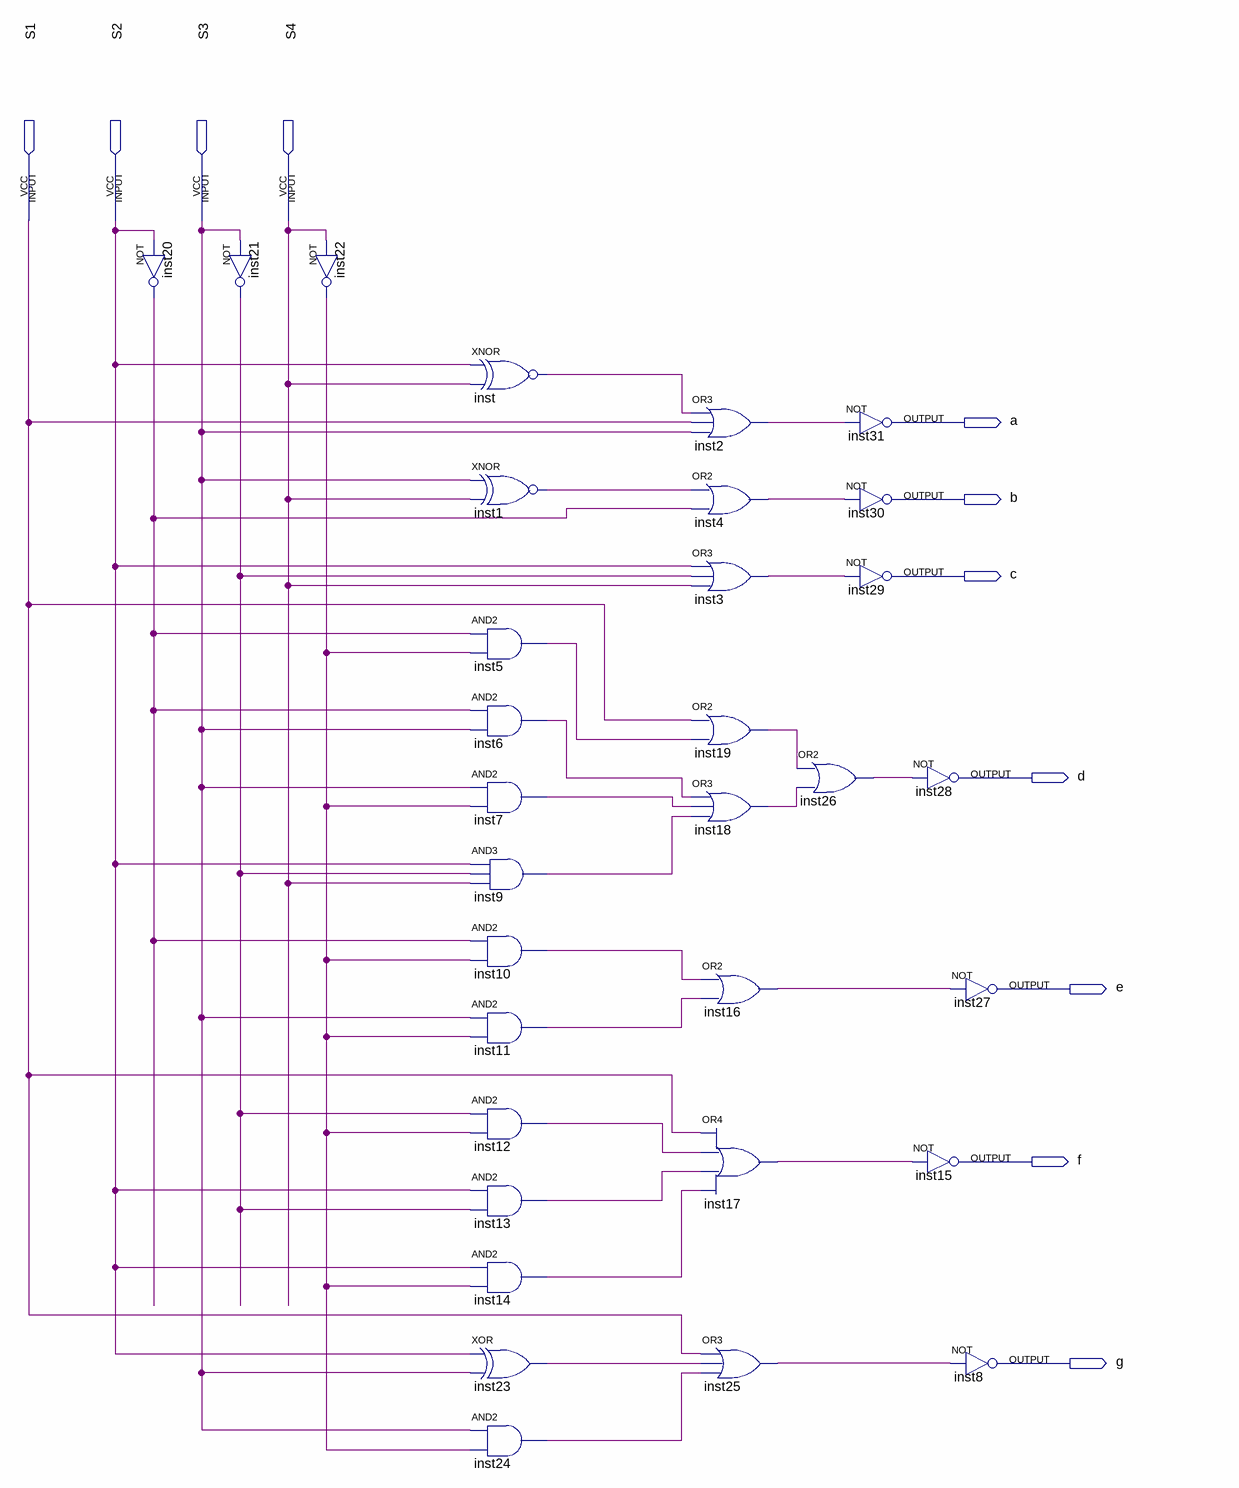
[diagram p0: schematic sheet]
// Quartus schematic Seven_Segment_Display.bdf as structural Verilog: 32 symbols, 11 pins
module Seven_Segment_Display (
  input  S1,
  input  S2,
  input  S3,
  input  S4,
  output a,
  output b,
  output c,
  output d,
  output e,
  output f,
  output g
);

  wire inst1_out, inst2_out, inst3_out, inst4_out, inst5_out, inst6_out, inst7_out, inst9_out, inst10_out,
       inst11_out, inst12_out, inst13_out, inst14_out, inst16_out, inst17_out, inst18_out, inst19_out,
       inst20_out, inst21_out, inst22_out, inst23_out, inst24_out, inst25_out, inst26_out, inst_out;

  not inst20 (inst20_out, S2);
  not inst21 (inst21_out, S3);
  not inst22 (inst22_out, S4);
  xnor inst (inst_out, S2, S4);
  xnor inst1 (inst1_out, S3, S4);
  and inst5 (inst5_out, inst20_out, inst22_out);
  and inst6 (inst6_out, inst20_out, S3);
  and inst7 (inst7_out, S3, inst22_out);
  and inst9 (inst9_out, S2, inst21_out, S4);
  and inst10 (inst10_out, inst20_out, inst22_out);
  and inst11 (inst11_out, S3, inst22_out);
  and inst12 (inst12_out, inst21_out, inst22_out);
  and inst13 (inst13_out, S2, inst21_out);
  and inst14 (inst14_out, S2, inst22_out);
  xor inst23 (inst23_out, S2, S3);
  and inst24 (inst24_out, S3, inst22_out);
  or inst2 (inst2_out, inst_out, S1, S3);
  or inst4 (inst4_out, inst1_out, inst20_out);
  or inst3 (inst3_out, S2, inst21_out, S4);
  or inst19 (inst19_out, S1, inst5_out);
  or inst18 (inst18_out, inst6_out, inst7_out, inst9_out);
  or inst16 (inst16_out, inst10_out, inst11_out);
  or inst17 (inst17_out, S1, inst12_out, inst13_out, inst14_out);
  or inst25 (inst25_out, S1, inst23_out, inst24_out);
  or inst26 (inst26_out, inst19_out, inst18_out);
  not inst31 (a, inst2_out);
  not inst30 (b, inst4_out);
  not inst29 (c, inst3_out);
  not inst28 (d, inst26_out);
  not inst27 (e, inst16_out);
  not inst15 (f, inst17_out);
  not inst8 (g, inst25_out);
endmodule
